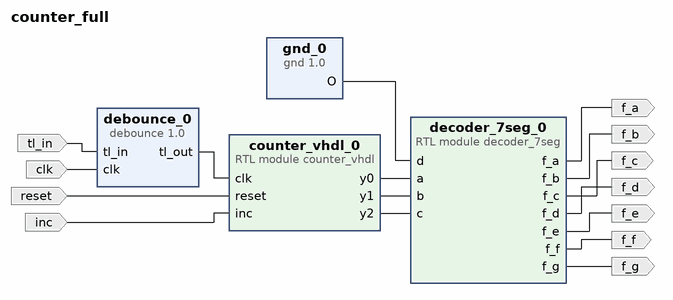
[diagram p0: block diagram of the top level]
# Vivado block design counter_full, xc7a35tcpg236-1, Vivado 2018.2.1
create_bd_design counter_full

create_bd_port -dir I tl_in
create_bd_port -dir I -type ce clk
create_bd_port -dir I -type rst reset
set_property -dict {CONFIG.POLARITY ACTIVE_HIGH} [get_bd_ports reset]
create_bd_port -dir I inc
create_bd_port -dir O f_a
create_bd_port -dir O f_b
create_bd_port -dir O f_c
create_bd_port -dir O f_d
create_bd_port -dir O f_e
create_bd_port -dir O f_f
create_bd_port -dir O f_g

create_bd_cell -type ip -vlnv FIT:user:debounce:1.0 debounce_0
create_bd_cell -type module -reference decoder_7seg decoder_7seg_0
create_bd_cell -type ip -vlnv FIT:user:gnd:1.0 gnd_0
create_bd_cell -type module -reference counter_vhdl counter_vhdl_0

# ---- connections ----

connect_bd_net [get_bd_pins gnd_0/O] [get_bd_pins decoder_7seg_0/d]
connect_bd_net -net tl_in_0_1 [get_bd_ports tl_in] [get_bd_pins debounce_0/tl_in]
connect_bd_net [get_bd_ports clk] [get_bd_pins debounce_0/clk]
connect_bd_net [get_bd_pins decoder_7seg_0/f_a] [get_bd_ports f_a]
connect_bd_net [get_bd_pins decoder_7seg_0/f_b] [get_bd_ports f_b]
connect_bd_net [get_bd_pins decoder_7seg_0/f_c] [get_bd_ports f_c]
connect_bd_net [get_bd_pins decoder_7seg_0/f_d] [get_bd_ports f_d]
connect_bd_net [get_bd_pins decoder_7seg_0/f_e] [get_bd_ports f_e]
connect_bd_net [get_bd_pins decoder_7seg_0/f_f] [get_bd_ports f_f]
connect_bd_net [get_bd_pins decoder_7seg_0/f_g] [get_bd_ports f_g]
connect_bd_net [get_bd_ports reset] [get_bd_pins counter_vhdl_0/reset]
connect_bd_net [get_bd_ports inc] [get_bd_pins counter_vhdl_0/inc]
connect_bd_net [get_bd_pins debounce_0/tl_out] [get_bd_pins counter_vhdl_0/clk]
connect_bd_net [get_bd_pins counter_vhdl_0/y0] [get_bd_pins decoder_7seg_0/a]
connect_bd_net [get_bd_pins counter_vhdl_0/y1] [get_bd_pins decoder_7seg_0/b]
connect_bd_net [get_bd_pins counter_vhdl_0/y2] [get_bd_pins decoder_7seg_0/c]

validate_bd_design
save_bd_design
